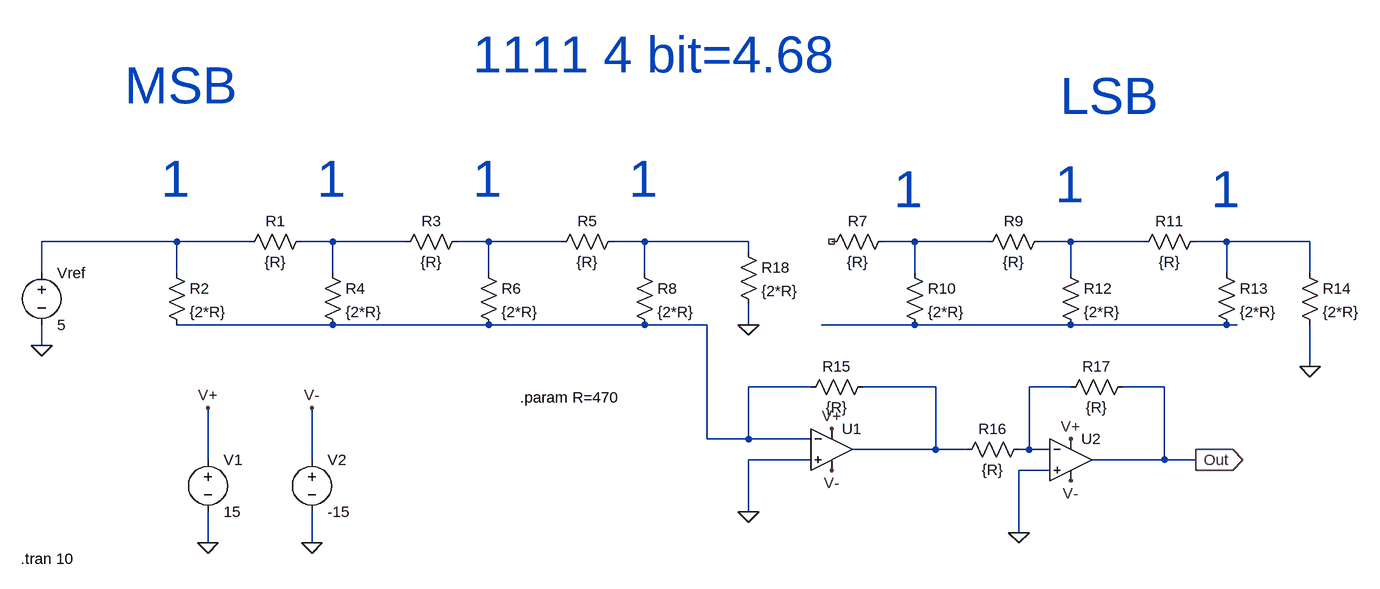
[diagram p0: schematic DAC_R2r.asc]
DAC_R2r.asc, the LTspice schematic file:
Version 4
SHEET 1 1920 680
WIRE 80 48 -128 48
WIRE 192 48 80 48
WIRE 320 48 272 48
WIRE 432 48 320 48
WIRE 560 48 512 48
WIRE 672 48 560 48
WIRE 800 48 752 48
WIRE 960 48 800 48
WIRE 1216 48 1168 48
WIRE 1328 48 1216 48
WIRE 1456 48 1408 48
WIRE 1568 48 1456 48
WIRE 1696 48 1648 48
WIRE 1824 48 1696 48
WIRE 960 64 960 48
WIRE -128 96 -128 48
WIRE 80 96 80 48
WIRE 320 96 320 48
WIRE 560 96 560 48
WIRE 800 96 800 48
WIRE 1216 96 1216 48
WIRE 1456 96 1456 48
WIRE 1696 96 1696 48
WIRE 1824 96 1824 48
WIRE 320 176 80 176
WIRE 560 176 320 176
WIRE 800 176 560 176
WIRE 896 176 800 176
WIRE 960 176 960 144
WIRE 1216 176 1072 176
WIRE 1456 176 1216 176
WIRE 1696 176 1456 176
WIRE 1712 176 1696 176
WIRE -128 208 -128 176
WIRE 1824 240 1824 176
WIRE 1056 272 960 272
WIRE 1248 272 1136 272
WIRE 1456 272 1392 272
WIRE 1600 272 1536 272
WIRE 896 352 896 176
WIRE 960 352 960 272
WIRE 960 352 896 352
WIRE 1056 352 960 352
WIRE 1248 368 1248 272
WIRE 1248 368 1120 368
WIRE 1296 368 1248 368
WIRE 1392 368 1392 272
WIRE 1392 368 1376 368
WIRE 1424 368 1392 368
WIRE 128 384 128 304
WIRE 288 384 288 304
WIRE 1056 384 960 384
WIRE 1600 384 1600 272
WIRE 1600 384 1488 384
WIRE 1648 384 1600 384
WIRE 1424 400 1376 400
WIRE 960 464 960 384
WIRE 1376 496 1376 400
WIRE 128 512 128 464
WIRE 288 512 288 464
FLAG -128 208 0
FLAG 1824 240 0
FLAG 128 304 V+
FLAG 288 304 V-
FLAG 128 512 0
FLAG 288 512 0
FLAG 960 464 0
FLAG 1088 336 V+
FLAG 1088 400 V-
FLAG 1648 384 Out
IOPIN 1648 384 Out
FLAG 1376 496 0
FLAG 1456 416 V-
FLAG 1456 352 V+
FLAG 960 176 0
SYMBOL voltage -128 80 R0
WINDOW 123 0 0 Left 0
WINDOW 39 0 0 Left 0
SYMATTR InstName Vref
SYMATTR Value 5
SYMBOL res 64 80 R0
SYMATTR InstName R2
SYMATTR Value {2*R}
SYMBOL res 288 32 R90
WINDOW 0 0 56 VBottom 2
WINDOW 3 32 56 VTop 2
SYMATTR InstName R1
SYMATTR Value {R}
SYMBOL res 304 80 R0
SYMATTR InstName R4
SYMATTR Value {2*R}
SYMBOL res 528 32 R90
WINDOW 0 0 56 VBottom 2
WINDOW 3 32 56 VTop 2
SYMATTR InstName R3
SYMATTR Value {R}
SYMBOL res 544 80 R0
SYMATTR InstName R6
SYMATTR Value {2*R}
SYMBOL res 768 32 R90
WINDOW 0 0 56 VBottom 2
WINDOW 3 32 56 VTop 2
SYMATTR InstName R5
SYMATTR Value {R}
SYMBOL res 784 80 R0
SYMATTR InstName R8
SYMATTR Value {2*R}
SYMBOL res 1184 32 R90
WINDOW 0 0 56 VBottom 2
WINDOW 3 32 56 VTop 2
SYMATTR InstName R7
SYMATTR Value {R}
SYMBOL res 1200 80 R0
SYMATTR InstName R10
SYMATTR Value {2*R}
SYMBOL res 1424 32 R90
WINDOW 0 0 56 VBottom 2
WINDOW 3 32 56 VTop 2
SYMATTR InstName R9
SYMATTR Value {R}
SYMBOL res 1440 80 R0
SYMATTR InstName R12
SYMATTR Value {2*R}
SYMBOL res 1664 32 R90
WINDOW 0 0 56 VBottom 2
WINDOW 3 32 56 VTop 2
SYMATTR InstName R11
SYMATTR Value {R}
SYMBOL res 1680 80 R0
SYMATTR InstName R13
SYMATTR Value {2*R}
SYMBOL res 1808 80 R0
SYMATTR InstName R14
SYMATTR Value {2*R}
SYMBOL voltage 128 368 R0
SYMATTR InstName V1
SYMATTR Value 15
SYMBOL voltage 288 368 R0
SYMATTR InstName V2
SYMATTR Value -15
SYMBOL res 1152 256 R90
WINDOW 0 0 56 VBottom 2
WINDOW 3 32 56 VTop 2
SYMATTR InstName R15
SYMATTR Value {R}
SYMBOL res 1392 352 R90
WINDOW 0 0 56 VBottom 2
WINDOW 3 32 56 VTop 2
SYMATTR InstName R16
SYMATTR Value {R}
SYMBOL res 1552 256 R90
WINDOW 0 0 56 VBottom 2
WINDOW 3 32 56 VTop 2
SYMATTR InstName R17
SYMATTR Value {R}
SYMBOL OpAmps\\UniversalOpAmp2 1088 368 R0
SYMATTR InstName U1
SYMBOL OpAmps\\UniversalOpAmp2 1456 384 R0
SYMATTR InstName U2
SYMBOL res 944 48 R0
SYMATTR InstName R18
SYMATTR Value {2*R}
TEXT 56 -48 Left 6 ;1
TEXT 296 -48 Left 6 ;1
TEXT 536 -48 Left 6 ;1
TEXT 776 -48 Left 6 ;1
TEXT 1184 -32 Left 6 ;1
TEXT 1432 -40 Left 6 ;1
TEXT 0 -192 Left 6 ;MSB
TEXT 1440 -176 Left 6 ;LSB
TEXT 1672 -32 Left 6 ;1
TEXT 608 288 Left 2 !.param R=470
TEXT 536 -240 Left 6 ;1111 4 bit=4.68
TEXT -160 536 Left 2 !.tran 10

The netlist it stands for:
* DAC_R2r.asc
Vref N001 0 5
R2 N001 N008 {2*R}
R1 N002 N001 {R}
R4 N002 N008 {2*R}
R3 N003 N002 {R}
R6 N003 N008 {2*R}
R5 N004 N003 {R}
R8 N004 N008 {2*R}
R7 N005 NC_01 {R}
R10 N005 N009 {2*R}
R9 N006 N005 {R}
R12 N006 N009 {2*R}
R11 N007 N006 {R}
R13 N007 N009 {2*R}
R14 N007 0 {2*R}
V1 V+ 0 15
V2 V- 0 -15
R15 N010 N008 {R}
R16 N011 N010 {R}
R17 Out N011 {R}
XU1 0 N008 V+ V- N010 level2 Avol=1Meg GBW=10Meg Slew=10Meg Ilimit=25m Rail=0 Vos=0 En=0 Enk=0 In=0 Ink=0 Rin=500Meg  ; pins In+ In- V+ V- OUT
XU2 0 N011 V+ V- Out level2 Avol=1Meg GBW=10Meg Slew=10Meg Ilimit=25m Rail=0 Vos=0 En=0 Enk=0 In=0 Ink=0 Rin=500Meg  ; pins In+ In- V+ V- OUT
R18 N004 0 {2*R}
* 1
* 1
* 1
* 1
* 1
* 1
* MSB
* LSB
* 1
.param R=470
* 1111 4 bit=4.68
.tran 10
.lib UniversalOpAmp2.lib
.backanno
.end